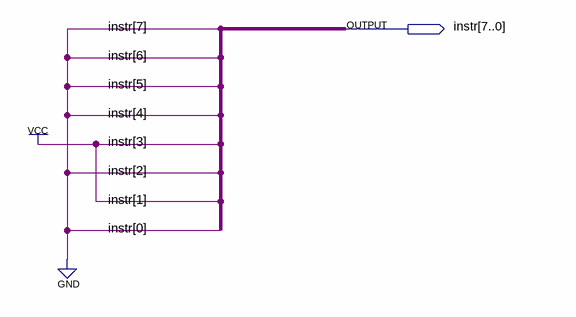
[diagram p0: schematic sheet]
// Quartus schematic addULA.bdf as structural Verilog: 0 symbols, 1 pins
module addULA (
  output [7:0] instr
);


  assign instr = 8'b00001010;
endmodule
